# Altium project RobotControlBoard.PrjPcb
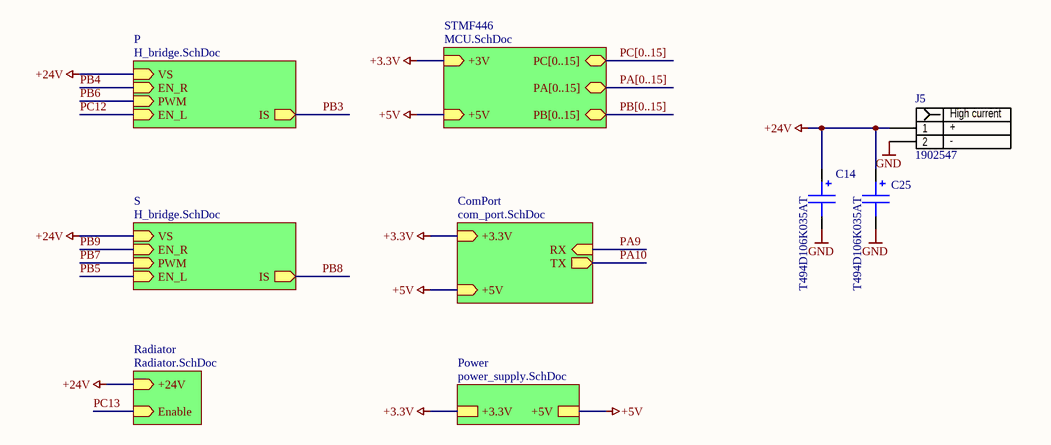
[diagram p0: MAIN.SchDoc]
6 sheets, 70 parts. Net scope: hierarchical (ports join the sheet entries above them; power ports are global).
Board file: RobotPCB.PcbDoc
Sheets:
  MAIN.SchDoc
    STMF446 = MCU.SchDoc
    P = H_bridge.SchDoc
    S = H_bridge.SchDoc
    СomPort = com_port.SchDoc
    Power = power_supply.SchDoc
    Radiator = Radiator.SchDoc

## Sheet MAIN.SchDoc: Main
size A4; DrawnBy: Zigman Nikita; Organization: Zigman Nikita; Address3: zigman.nikita@gmail.com; DocumentNumber: 1.0; Revision: ZN; SheetNumber: 1; SheetTotal: 6

### Parts
C14  T494D106K035AT  [CAPPM7343X310N]
C25  T494D106K035AT  [CAPPM7343X310N]
J5  1902547  [1902547]

### Sub-sheets
P = H_bridge.SchDoc: EN_R (in), IS (out), PWM (in), EN_L (in), VS (in)
Power = power_supply.SchDoc: +5V, +3.3V
Radiator = Radiator.SchDoc: Enable (in), +24V (in)
S = H_bridge.SchDoc: EN_R (in), PWM (in), EN_L (in), VS (in), IS (out)
STMF446 = MCU.SchDoc: PC[0..15] (bidir), PA[0..15] (bidir), +3V (in), PB[0..15] (bidir), +5V (in)
СomPort = com_port.SchDoc: RX (in), +3.3V (in), TX (out), +5V (in)

### Nets
+3.3V: sheet STMF446/+3V, sheet СomPort/+3.3V, sheet Power/+3.3V
+5V: sheet STMF446/+5V, sheet СomPort/+5V, sheet Power/+5V  [project net VBUS]
+24V: C14.1(+) C25.1(+) J5.1 ; sheet P/VS, sheet S/VS, sheet Radiator/+24V  [project net VS]
GND: C14.2(-) C25.2(-) J5.2

### Buses and harness runs
bus PA[0..15] = sheet STMF446/PA[0..15]
bus PB[0..15] = sheet STMF446/PB[0..15]
bus PC[0..15] = sheet STMF446/PC[0..15]

### Notes on the sheet
- Title
- Size:
- Date:
- A4
- Number:
- Time:
- Revision:
- Sheet
- of
- File:
- (in symbol 1902547) High current; +; -

### Library data of the parts
C14 C25 = T494D106K035AT: Capacitor Polarised; Manufacturer_Name: Kemet; Datasheet Link: http://www.mouser.com/ds/2/212/kemet_kem_t2008_t494-544880.pdf; Height: 3.1mm; Manufacturer_Part_Number: T494D106K035AT; Arrow Part Number: T494D106K035AT; Arrow Price/Stock: https://www.arrow.com/en/products/t494d106k035at/kemet-corporation; Mouser Part Number: 80-T494D106K035; Mouser Price/Stock: https://www.mouser.com/Search/Refine.aspx?Keyword=80-T494D106K035
J5 = 1902547: Connector; Manufacturer_Name: Phoenix Contact; Datasheet Link: https://www.arrow.com/en/products/1902547/phoenix-contact; Height: 21.7mm; Manufacturer_Part_Number: 1902547; Arrow Part Number: 1902547; Arrow Price/Stock: https://www.arrow.com/en/products/1902547/phoenix-contact; Mouser Part Number: 651-1902547; Mouser Price/Stock: https://www.mouser.co.uk/ProductDetail/Phoenix-Contact/1902547?qs=wd%252Bw3mUqFrmbAnEXicRpKg%3D%3D

## Sheet MCU.SchDoc: MCU
size A4; Organization: Zigman NIkita; Address3: zigman.nikita@gmail.com; DocumentNumber: 1.0; Revision: ZN; SheetNumber: 2; SheetTotal: 6
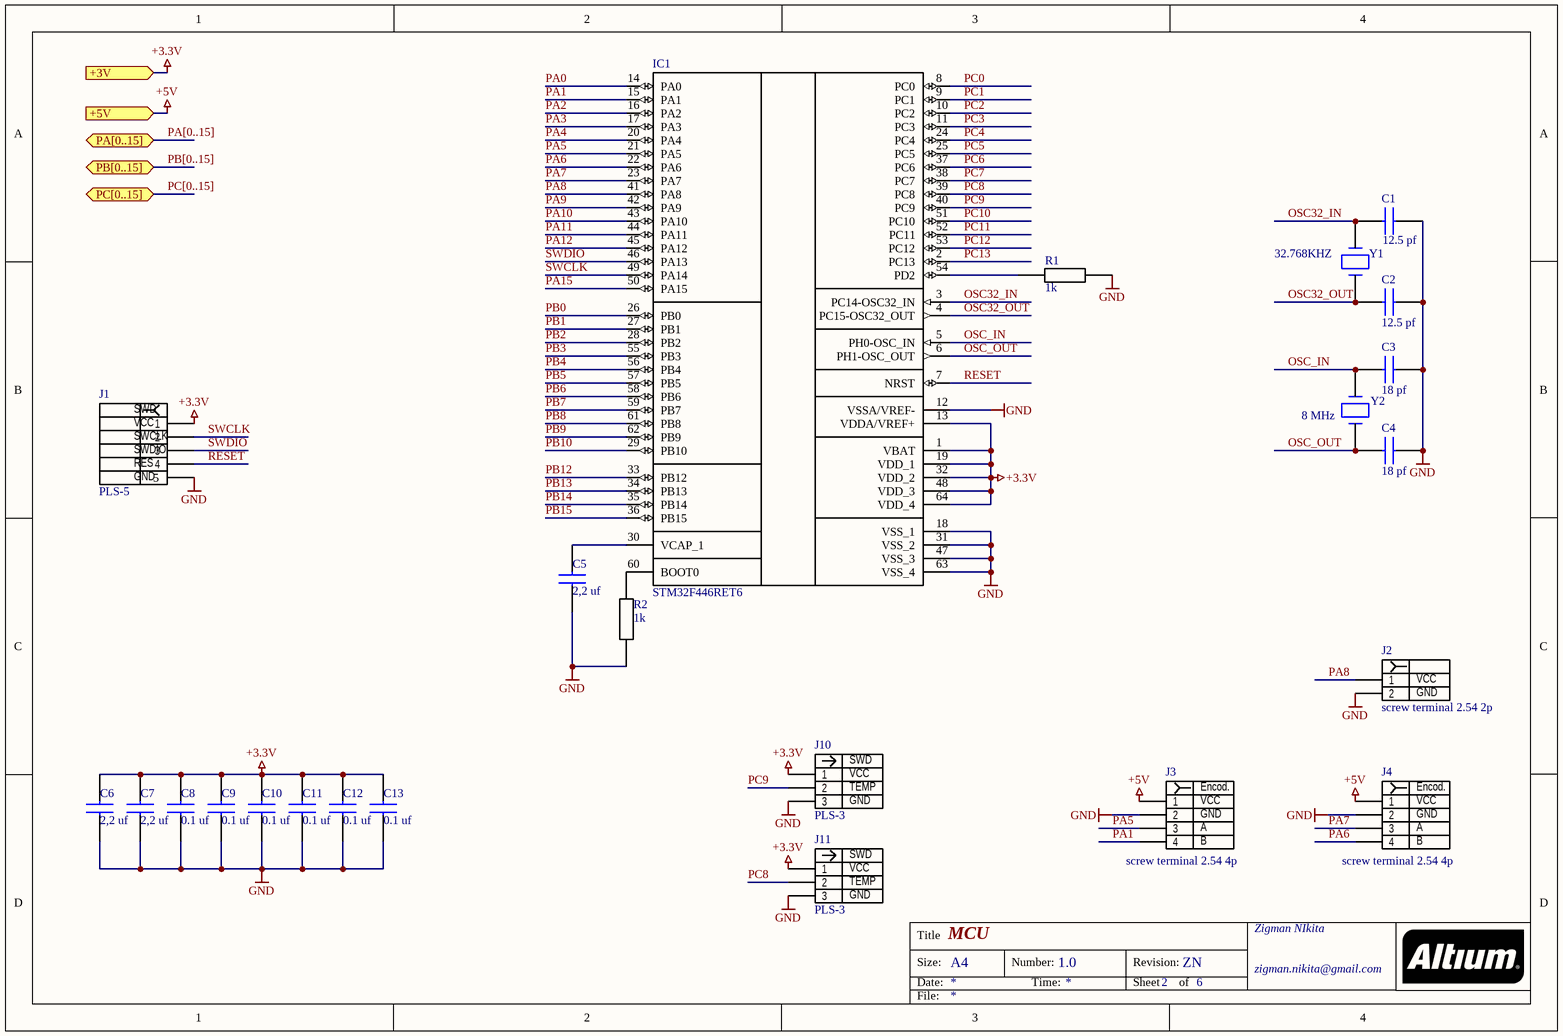
[diagram p1: MCU.SchDoc]

### Parts
C1  12.5 pf  [CAPC1608X90N]
C2  12.5 pf  [CAPC1608X90N]
C3  18 pf  [CAPC1608X90N]
C4  18 pf  [CAPC1608X90N]
C5  2,2 uf  [CAPC1608X90N]
C6  2,2 uf  [CAPC1608X90N]
C7  2,2 uf  [CAPC1608X90N]
C8  0.1 uf  [CAPC1608X90N]
C9  0.1 uf  [CAPC1608X90N]
C10  0.1 uf  [CAPC1608X90N]
C11  0.1 uf  [CAPC1608X90N]
C12  0.1 uf  [CAPC1608X90N]
C13  0.1 uf  [CAPC1608X90N]
IC1  STM32F446RET6  [QFP50P1200X1200X160-64N]
J1  PLS-5  [TE_826646-5]
J2  screw terminal 2.54 2p  [1725672-2-2.54]
J3  screw terminal 2.54 4p  [1725672-4-2.54]
J4  screw terminal 2.54 4p  [1725672-4-2.54]
J10  PLS-3  [TE_826646-3]
J11  PLS-3  [TE_826646-3]
R1  1k  [RESC1608X55N]
R2  1k  [RESC1608X55N]
Y1  32.768KHZ  [9HT1132768KDZBT]
Y2  8 MHz  [ABM2]

### Ports
+3V (in), +5V (in), PA[0..15] (bidir), PB[0..15] (bidir), PC[0..15] (bidir)

### Nets
+3.3V: C6.2 C7.2 C8.2 C9.2 C10.2 C11.2 C12.2 C13.2 IC1.1(VBAT) IC1.13(VDDA/VREF+) IC1.19(VDD_1) IC1.32(VDD_2) IC1.48(VDD_3) IC1.64(VDD_4) J1.1 J10.1 J11.1 ; port +3V
+5V: J3.1 J4.1 ; port +5V  [project net VBUS]
GND: C1.1 C2.1 C3.1 C4.1 C5.1 C6.1 C7.1 C8.1 C9.1 C10.1 C11.1 C12.1 C13.1 IC1.12(VSSA/VREF-) IC1.18(VSS_1) IC1.31(VSS_2) IC1.47(VSS_3) IC1.63(VSS_4) J1.5 J2.2 J3.2 J4.2 J10.3 J11.3 R1.1 R2.2
OSC32_IN: C1.2 IC1.3(PC14-OSC32_IN) Y1.2
OSC32_OUT: C2.2 IC1.4(PC15-OSC32_OUT) Y1.1
OSC_IN: C3.2 IC1.5(PH0-OSC_IN) Y2.2
OSC_OUT: C4.2 IC1.6(PH1-OSC_OUT) Y2.1
PA0: IC1.14(PA0)
PA1: IC1.15(PA1) J3.4
PA2: IC1.16(PA2)
PA3: IC1.17(PA3)
PA4: IC1.20(PA4)
PA5: IC1.21(PA5) J3.3
PA6: IC1.22(PA6) J4.4
PA7: IC1.23(PA7) J4.3
PA8: IC1.41(PA8) J2.1
PA9: IC1.42(PA9)
PA10: IC1.43(PA10)
PA11: IC1.44(PA11)
PA12: IC1.45(PA12)
PA15: IC1.50(PA15)
PB0: IC1.26(PB0)
PB1: IC1.27(PB1)
PB2: IC1.28(PB2)
PB3: IC1.55(PB3)  [project net IS]
PB4: IC1.56(PB4)  [project net EN_R]
PB5: IC1.57(PB5)  [project net EN_L]
PB6: IC1.58(PB6)
PB7: IC1.59(PB7)
PB8: IC1.61(PB8)  [project net IS]
PB9: IC1.62(PB9)  [project net EN_R]
PB10: IC1.29(PB10)
PB12: IC1.33(PB12)
PB13: IC1.34(PB13)
PB14: IC1.35(PB14)
PB15: IC1.36(PB15)
PC0: IC1.8(PC0)
PC1: IC1.9(PC1)
PC2: IC1.10(PC2)
PC3: IC1.11(PC3)
PC4: IC1.24(PC4)
PC5: IC1.25(PC5)
PC6: IC1.37(PC6)
PC7: IC1.38(PC7)
PC8: IC1.39(PC8) J11.2
PC9: IC1.40(PC9) J10.2
PC10: IC1.51(PC10)
PC11: IC1.52(PC11)
PC12: IC1.53(PC12)  [project net EN_L]
PC13: IC1.2(PC13)
RESET: IC1.7(NRST) J1.4
SWCLK: IC1.49(PA14) J1.2
SWDIO: IC1.46(PA13) J1.3
NetC5_2: C5.2 IC1.30(VCAP_1)
NetIC1_54: IC1.54(PD2) R1.2
NetIC1_60: IC1.60(BOOT0) R2.1

### Buses and harness runs
bus PA[0..15] = port PA[0..15]
bus PB[0..15] = port PB[0..15]
bus PC[0..15] = port PC[0..15]

### Notes on the sheet
- Title
- Size:
- Date:
- A4
- Number:
- Time:
- Revision:
- Sheet
- of
- File:
- (in symbol PLS-3) SWD; VCC; TEMP; GND
- (in symbol PLS-5) SWD; VCC; SWCLK; SWDIO; RES; GND
- (in symbol screw terminal 2.54 2p) VCC; GND
- (in symbol screw terminal 2.54 4p) Encod.; VCC; GND; A; B

### Library data of the parts
C1-C4 = 0603: AVX 18pF 200V dc 0603; Datasheet Link: https://at.rs-online.com/web/p/keramik-vielschichtkondensatoren/6983970/; Height: 0.9mm; Manufacturer_Name: AVX
C5-C7 = 0603: Murata 2.2 uF X7R 10% 10V dc 0603; Manufacturer_Part_Number: 06033C393JAT2A; Datasheet Link: https://at.rs-online.com/web/p/keramik-vielschichtkondensatoren/7235597/; Height: 0.9mm; Manufacturer_Name: Murata
C8-C13 = 0603: AVX 0.1 uF 16v dc 0603; Datasheet Link: https://at.rs-online.com/web/p/keramik-vielschichtkondensatoren/1358340/; Height: 0.9mm; Manufacturer_Name: AVX
IC1 = STM32F446RET6: Integrated Circuit; Manufacturer_Name: STMicroelectronics; Datasheet Link: http://docs-emea.rs-online.com/webdocs/14d7/0900766b814d7c59.pdf; Height: 1.6mm; Manufacturer_Part_Number: STM32F446RET6; Arrow Part Number: STM32F446RET6; Arrow Price/Stock: https://www.arrow.com/en/products/stm32f446ret6/stmicroelectronics; Mouser Part Number: 511-STM32F446RET6; Mouser Price/Stock: https://www.mouser.co.uk/ProductDetail/STMicroelectronics/STM32F446RET6?qs=Ok1pvOkw6%2FqpQsWf8F4wtQ%3D%3D
J1 = PLS-5: Board-To-Board Connector, Through Hole, Header, 5, 2.54 mm, Gold Plated Contacts; MF: TE Connectivity; MP: 826646-5; SnapEDA_Link: https://www.snapeda.com/parts/826646-5/TE%20Connectivity%20AMP%20Connectors/view-part/2389611/?ref=snap; TE_purchase_URL: https://www.te.com/usa-en/product-826646-5.html?te_bu=Cor&te_type=disp&te_campaign=seda_glo_cor-seda-global-disp-prtnr-fy19-seda-model-bom-cta_sma-317_1&elqCampaignId=32493; Availability: Unavailable; Value: *; EU_RoHS_Compliance: Compliant; Price: None; Package: None
J2 = screw terminal 2.54 2p: Connector; Manufacturer_Name: Phoenix Contact; Manufacturer_Part_Number: 1725672; Datasheet Link: https://www.phoenixcontact.com/online/portal/us?uri=pxc-oc-itemdetail:pid=1725672&library=usen&tab=1.pdf; Arrow Part Number: 1725672; Arrow Price/Stock: https://www.arrow.com/en/products/1725672/phoenix-contact; Mouser Part Number: 651-1725672; Mouser Price/Stock: https://www.mouser.co.uk/ProductDetail/Phoenix-Contact/1725672?qs=Ul7CXFMnlWXX93F9bOV2pQ%3D%3D
J3 J4 = screw terminal 2.54 4p: Connector; Manufacturer_Name: Phoenix Contact; Manufacturer_Part_Number: 1725672; Datasheet Link: https://www.phoenixcontact.com/online/portal/us?uri=pxc-oc-itemdetail:pid=1725672&library=usen&tab=1.pdf; Arrow Part Number: 1725672; Arrow Price/Stock: https://www.arrow.com/en/products/1725672/phoenix-contact; Mouser Part Number: 651-1725672; Mouser Price/Stock: https://www.mouser.co.uk/ProductDetail/Phoenix-Contact/1725672?qs=Ul7CXFMnlWXX93F9bOV2pQ%3D%3D
J10 J11 = PLS-3: Board-To-Board Connector, Through Hole, Header, 5, 2.54 mm, Gold Plated Contacts; MF: TE Connectivity; MP: 826646-5; SnapEDA_Link: https://www.snapeda.com/parts/826646-5/TE%20Connectivity%20AMP%20Connectors/view-part/2389611/?ref=snap; TE_purchase_URL: https://www.te.com/usa-en/product-826646-5.html?te_bu=Cor&te_type=disp&te_campaign=seda_glo_cor-seda-global-disp-prtnr-fy19-seda-model-bom-cta_sma-317_1&elqCampaignId=32493; Availability: Unavailable; Value: *; EU_RoHS_Compliance: Compliant; Price: None; Package: None
R1 R2 = res 0603: RS PRO SMD-Widerstand, 1kΩ ±5%; Manufacturer_Name: RS PRO; Datasheet Link: https://at.rs-online.com/web/p/smd-widerstande/7134141/; Height: 0.55mm
Y1 = CM7V-T1A 32.768KHZ: Quarz CM7V-T1A 32.768KHZ 7PF +/-20PPM TB QA 32.768kHz, ±20ppm; Manufacturer_Name: CM7V; Datasheet Link: https://at.rs-online.com/web/p/schwingquarz/1735831/; Height: 0.6mm; Manufacturer_Part_Number: CM7V-T1A
Y2 = ABM2-8.000MHZ-D4Y-T: Quarz ABM2-8.000MHZ-D4Y-T 8MHz, ±30ppm; Manufacturer_Name: ABM; Datasheet Link: https://at.rs-online.com/web/p/schwingquarz/1710612/; Height: 1.6 mm; Manufacturer_Part_Number: ABM2-8.000MHZ-D4Y-T

## Sheet H_bridge.SchDoc: H bridge
size A4; Organization: Zigman NIkita; Address3: zigman.nikita@gmail.com; DocumentNumber: 1.0; Revision: ZN; SheetNumber: 3; SheetTotal: 6
Used 2 times, as channels P, S. Parts and nets are listed once, with the designators drawn on the sheet.
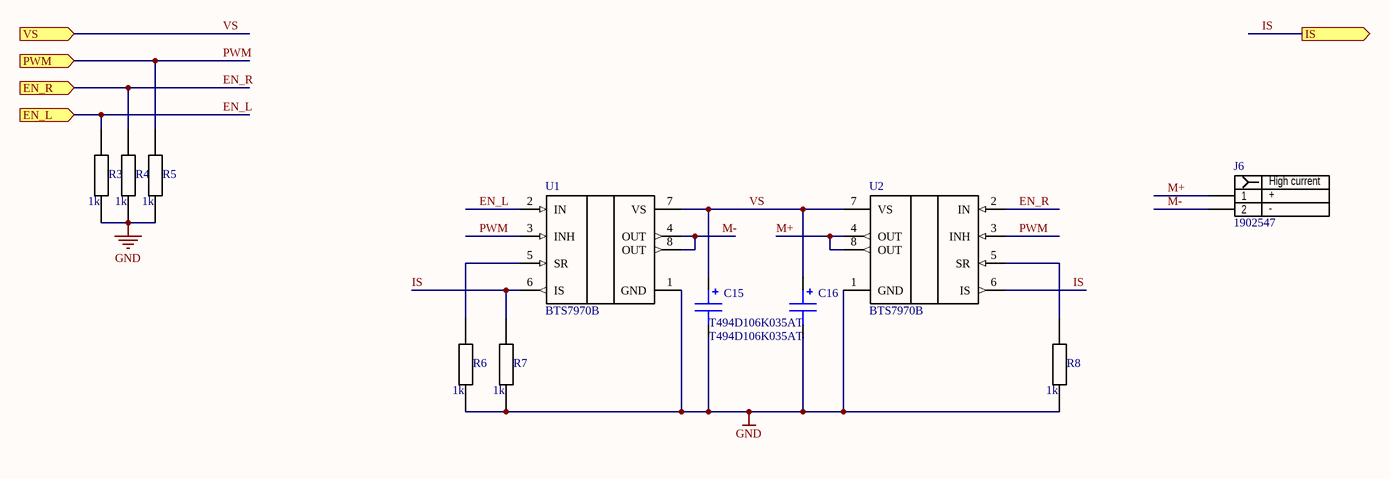
[diagram p2: H_bridge.SchDoc]

### Parts
C15  T494D106K035AT  [CAPPM7343X310N]
C16  T494D106K035AT  [CAPPM7343X310N]
J6  1902547  [1902547]
R3  1k  [RESC1608X55N]
R4  1k  [RESC1608X55N]
R5  1k  [RESC1608X55N]
R6  1k  [RESC1608X55N]
R7  1k  [RESC1608X55N]
R8  1k  [RESC1608X55N]
U1  BTS7970B  [PG-TO263-7-1]
U2  BTS7970B  [PG-TO263-7-1]

### Ports
EN_L (in), EN_R (in), IS (out), PWM (in), VS (in)

### Nets
GND: C15.2(-) C16.2(-) R3.1 R4.1 R5.1 R6.1 R7.1 R8.1 U1.1(GND) U2.1(GND)
EN_L: R3.2 U1.2(IN) ; port EN_L
EN_R: R4.2 U2.2(IN) ; port EN_R
IS: R7.2 U1.6(IS) U2.6(IS) ; port IS
M+: J6.1 U2.4(OUT) U2.8(OUT)
M-: J6.2 U1.4(OUT) U1.8(OUT)
PWM: R5.2 U1.3(INH) U2.3(INH) ; port PWM
VS: C15.1(+) C16.1(+) U1.7(VS) U2.7(VS) ; port VS
NetR6_2: R6.2 U1.5(SR)
NetR8_2: R8.2 U2.5(SR)

### Channels
P: designators end in _P; ports EN_L=EN_L EN_R=EN_R IS=IS PWM=PB6 VS=VS
S: designators end in _S; ports EN_L=EN_L EN_R=EN_R IS=IS PWM=PB7 VS=VS

### Notes on the sheet
- Title
- Size:
- Date:
- A4
- Number:
- Time:
- Revision:
- Sheet
- of
- File:
- (in symbol 1902547) High current; +; -

### Library data of the parts
C15 C16 = T494D106K035AT: as C14 on sheet MAIN; Datasheet Link: http://www.mouser.com/ds/2/212/kemet_kem_t2008_t494-544880.pdf; Height: 3.1mm; Manufacturer_Part_Number: T494D106K035AT; Arrow Part Number: T494D106K035AT; Arrow Price/Stock: https://www.arrow.com/en/products/t494d106k035at/kemet-corporation; Mouser Part Number: 80-T494D106K035; Mouser Price/Stock: https://www.mouser.com/Search/Refine.aspx?Keyword=80-T494D106K035
J6 = 1902547: Phoenix Contact MKDS 5 HV/2-9.52; Datasheet Link: https://www.arrow.com/en/products/1902547/phoenix-contact; Height: 21.7mm; Manufacturer_Name: Phoenix Contact; Manufacturer_Part_Number: 1902547; Arrow Part Number: 1902547; Arrow Price/Stock: https://www.arrow.com/en/products/1902547/phoenix-contact; Mouser Part Number: 651-1902547; Mouser Price/Stock: https://www.mouser.co.uk/ProductDetail/Phoenix-Contact/1902547?qs=wd%252Bw3mUqFrmbAnEXicRpKg%3D%3D
R3-R8 = res 0603: as R1 on sheet MCU; Datasheet Link: https://at.rs-online.com/web/p/smd-widerstande/7134141/; Height: 0.55mm
U1 U2 = BTS7970B: Infineon Motor Driver IC BTN7970BAUMA1, 50A, 25kHz, TO-263, 7-Pin, BLDC; MF: Infineon; SnapEDA_Link: https://at.rs-online.com/web/p/motor-treiber-ics/7264068/; MP: BTS7970B; Price: None; Package: PG-TO263-7-1; Value: *; Availability: Unavailable

## Sheet com_port.SchDoc: COM Port
size A4; Organization: Zigman Nikita; Address3: zigman.nikita@gmail.com; DocumentNumber: 1.0; Revision: ZN; SheetNumber: 4; SheetTotal: 6
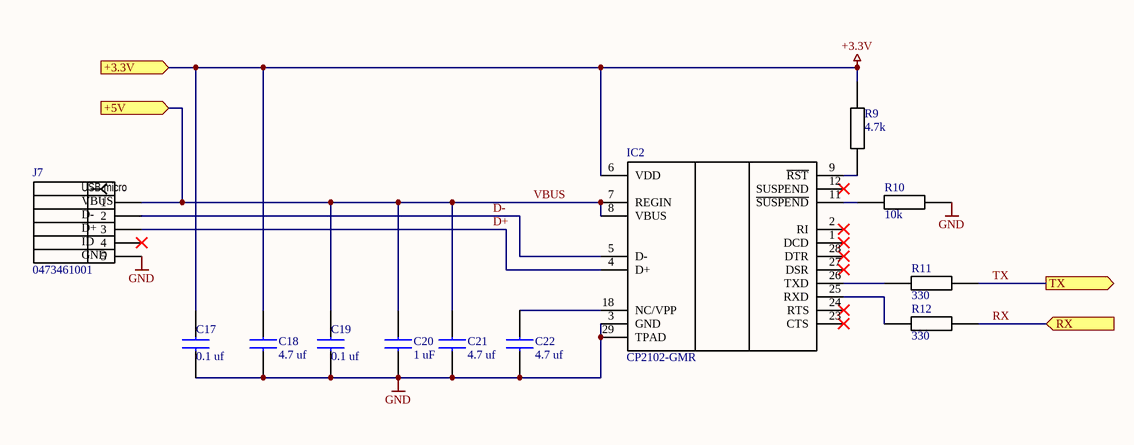
[diagram p3: com_port.SchDoc]

### Parts
C17  0.1 uf  [CAPC1608X90N]
C18  4.7 uf  [CAPC1608X90N]
C19  0.1 uf  [CAPC1608X90N]
C20  1 uF  [CAPC1608X90N]
C21  4.7 uf  [CAPC1608X90N]
C22  4.7 uf  [CAPC1608X90N]
IC2  CP2102-GMR  [QFN50P500X500X100-29N-D]
J7  0473461001  [0473461001]
R9  4.7k  [RESC1608X55N]
R10  10k  [RESC1608X55N]
R11  330  [RESC1608X55N]
R12  330  [RESC1608X55N]

### Ports
+3.3V (in), +5V (in), RX (in), TX (out)

### Nets
+3.3V: C17.2 C18.2 IC2.6(VDD) R9.2 ; port +3.3V
GND: C17.1 C18.1 C19.1 C20.1 C21.1 C22.1 IC2.3(GND) IC2.29(TPAD) J7.5 R10.1
VBUS: C19.2 C20.2 C21.2 IC2.7(REGIN) IC2.8(VBUS) J7.1 ; port +5V
D+: IC2.4(D+) J7.3
D-: IC2.5(D-) J7.2
RX: R12.1 ; port RX  [project net PA9]
TX: R11.1 ; port TX  [project net PA10]
NetC22_2: C22.2 IC2.18(NC/VPP)
NetIC2_9: IC2.9(~{RST}) R9.1
NetIC2_11: IC2.11(~{SUSPEND}) R10.2
NetIC2_25: IC2.25(RXD) R12.2
NetIC2_26: IC2.26(TXD) R11.2

Not connected (* = marked no-connect by the designer): IC2 1(DCD)* 2(RI)* 12(SUSPEND)* 23(CTS)* 24(RTS)* 27(DSR)* 28(DTR)*; J7 4*

### Notes on the sheet
- Title
- Size:
- Date:
- A4
- Number:
- Time:
- Revision:
- Sheet
- of
- File:
- (in symbol 0473461001) USB micro; VBUS; D-; D+; ID; GND

### Library data of the parts
C17 C19 = 0603: AVX 0.1 uF 16v dc 0603; Datasheet Link: https://at.rs-online.com/web/p/keramik-vielschichtkondensatoren/1358340/; Height: 0.9mm; Manufacturer_Name: AVX
C18 C21 C22 = 0603: AVX, SMD MLCC 4.7 uF 10 V dc, 0603; Datasheet Link: https://at.rs-online.com/web/p/keramik-vielschichtkondensatoren/1353676/; Height: 0.9mm; Manufacturer_Name: AVX
C20 = 0603: AVX SMD 1uF 16V 0603; Datasheet Link: https://at.rs-online.com/web/p/keramik-vielschichtkondensatoren/8882257/; Height: 0.9mm; Manufacturer_Name: AVX
IC2 = CP2102-GMR: Integrated Circuit; Manufacturer_Name: Silicon Labs; Datasheet Link: https://at.rs-online.com/web/p/multiprotokoll-transceiver/5268841/; Height: 1mm; Manufacturer_Part_Number: CP2102-GMR; Arrow Part Number: CP2102-GMR; Arrow Price/Stock: https://www.arrow.com/en/products/cp2102-gmr/silicon-labs; Mouser Part Number: 634-CP2102-GMR; Mouser Price/Stock: https://www.mouser.co.uk/ProductDetail/Silicon-Labs/CP2102-GMR?qs=cNyzPCcHMUWu%2FiPhR8KQAw%3D%3D
J7 = 0473461001: Connector; Manufacturer_Name: Molex; Datasheet Link: https://componentsearchengine.com/Datasheets/1/0473461001.pdf; Height: 2.45mm; Manufacturer_Part_Number: 0473461001; Arrow Part Number: 0473461001; Arrow Price/Stock: https://www.arrow.com/en/products/0473461001/molex; Mouser Part Number: N/A; Mouser Price/Stock: https://www.mouser.com/Search/Refine.aspx?Keyword=N%2FA
R9 = res 0603: 4.7k 0603; Manufacturer_Name: TE Connectivity; Manufacturer_Part_Number: CPF0603B100RE1; Datasheet Link: http://www.farnell.com/datasheets/1786775.pdf; Height: 0.55mm; Arrow Part Number: CPF0603B100RE1; Arrow Price/Stock: https://www.arrow.com/en/products/cpf0603b100re1/te-connectivity; Mouser Part Number: 279-CPF0603B100RE1; Mouser Price/Stock: https://www.mouser.co.uk/ProductDetail/TE-Connectivity-Neohm/CPF0603B100RE1?qs=DfH2yQaBz6s2KWheq2AlNw%3D%3D
R10 = res 0603: 10k 0603; Manufacturer_Name: TE Connectivity; Manufacturer_Part_Number: CPF0603B100RE1; Datasheet Link: http://www.farnell.com/datasheets/1786775.pdf; Height: 0.55mm; Arrow Part Number: CPF0603B100RE1; Arrow Price/Stock: https://www.arrow.com/en/products/cpf0603b100re1/te-connectivity; Mouser Part Number: 279-CPF0603B100RE1; Mouser Price/Stock: https://www.mouser.co.uk/ProductDetail/TE-Connectivity-Neohm/CPF0603B100RE1?qs=DfH2yQaBz6s2KWheq2AlNw%3D%3D
R11 R12 = res 0603: 330 0603; Manufacturer_Name: TE Connectivity; Manufacturer_Part_Number: CPF0603B100RE1; Datasheet Link: http://www.farnell.com/datasheets/1786775.pdf; Height: 0.55mm; Arrow Part Number: CPF0603B100RE1; Arrow Price/Stock: https://www.arrow.com/en/products/cpf0603b100re1/te-connectivity; Mouser Part Number: 279-CPF0603B100RE1; Mouser Price/Stock: https://www.mouser.co.uk/ProductDetail/TE-Connectivity-Neohm/CPF0603B100RE1?qs=DfH2yQaBz6s2KWheq2AlNw%3D%3D

## Sheet power_supply.SchDoc: Power supply
size A4; Organization: Zigman NIkita; Address3: zigman.nikita@gmail.com; DocumentNumber: 1.0; Revision: ZN; SheetNumber: 5; SheetTotal: 6
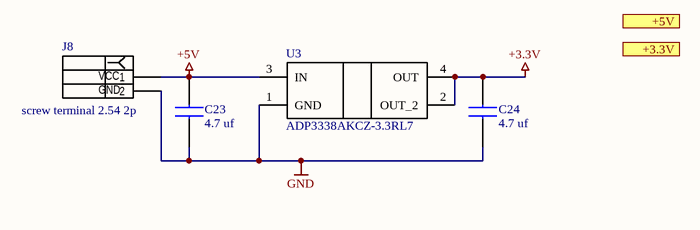
[diagram p4: power_supply.SchDoc]

### Parts
C23  4.7 uf  [CAPC1608X90N]
C24  4.7 uf  [CAPC1608X90N]
J8  screw terminal 2.54 2p  [1725672-2-2.54]
U3  ADP3338AKCZ-3.3RL7  [SOT230-3]

### Ports
+3.3V, +5V

### Nets
+3.3V: C24.2 U3.2(OUT_2) U3.4(OUT) ; port +3.3V
+5V: C23.2 J8.1 U3.3(IN) ; port +5V  [project net VBUS]
GND: C23.1 C24.1 J8.2 U3.1(GND)

### Notes on the sheet
- Title
- Size:
- Date:
- A4
- Number:
- Time:
- Revision:
- Sheet
- of
- File:
- (in symbol screw terminal 2.54 2p) VCC; GND

### Library data of the parts
C23 C24 = 0603: AVX, SMD MLCC 4.7 uF 10 V dc, 0603; Datasheet Link: https://at.rs-online.com/web/p/keramik-vielschichtkondensatoren/1353676/; Height: 0.9mm; Manufacturer_Name: AVX
J8 = screw terminal 2.54 2p: as J2 on sheet MCU; Datasheet Link: https://www.phoenixcontact.com/online/portal/us?uri=pxc-oc-itemdetail:pid=1725672&library=usen&tab=1.pdf; Arrow Part Number: 1725672; Arrow Price/Stock: https://www.arrow.com/en/products/1725672/phoenix-contact; Mouser Part Number: 651-1725672; Mouser Price/Stock: https://www.mouser.co.uk/ProductDetail/Phoenix-Contact/1725672?qs=Ul7CXFMnlWXX93F9bOV2pQ%3D%3D
U3 = ADP3338AKCZ-3.3RL7: Linear Voltage Regulator IC 1 Output 1A SOT-223-3; MF: Analog Devices; Value: *; Mouser-Purchase-URL: https://snapeda.com/shop?store=Mouser&id=51107; Package: SOT-223 Analog Devices; DigiKey-Purchase-URL: https://snapeda.com/shop?store=DigiKey&id=51107; Price: None; MP: ADP3338AKCZ-3.3RL7; Availability: Good; SnapEDA_Link: https://www.snapeda.com/parts/ADP3338AKCZ-3.3RL7/Analog%20Devices%20Inc./view-part/51107/?ref=snap; Arrow_Electronics-Purchase-URL: https://snapeda.com/shop?store=Arrow+Electronics&id=51107

## Sheet Radiator.SchDoc: Cooler
size A4; Organization: Zigman Nikita; Address3: zigman.nikita@gmail.com; DocumentNumber: 1.0; Revision: ZN; SheetNumber: 6; SheetTotal: 6
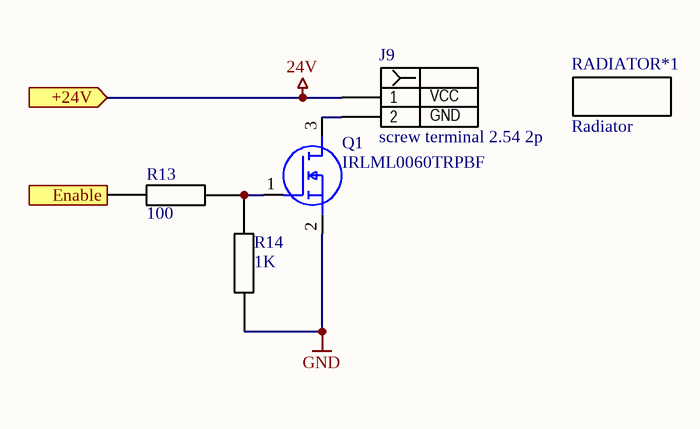
[diagram p5: Radiator.SchDoc]

### Parts
J9  screw terminal 2.54 2p  [1725672-2-2.54]
Q1  IRLML0060TRPBF  [SOT95P237X112-3N]
R13  100  [RESC1608X55N]
R14  1K  [RESC1608X55N]
RADIATOR*1  Radiator  [SK68-75-SA]

### Ports
+24V (in), Enable (in)

### Nets
24V: J9.1 ; port +24V  [project net VS]
GND: Q1.2(S) R14.1
PC13: R13.2 ; port Enable
NetJ9_2: J9.2 Q1.3(D)
NetQ1_1: Q1.1(G) R13.1 R14.2

### Notes on the sheet
- Title
- Size:
- Date:
- A4
- Number:
- Time:
- Revision:
- Sheet
- of
- File:
- (in symbol screw terminal 2.54 2p) VCC; GND

### Library data of the parts
J9 = screw terminal 2.54 2p: as J2 on sheet MCU; Datasheet Link: https://www.phoenixcontact.com/online/portal/us?uri=pxc-oc-itemdetail:pid=1725672&library=usen&tab=1.pdf; Arrow Part Number: 1725672; Arrow Price/Stock: https://www.arrow.com/en/products/1725672/phoenix-contact; Mouser Part Number: 651-1725672; Mouser Price/Stock: https://www.mouser.co.uk/ProductDetail/Phoenix-Contact/1725672?qs=Ul7CXFMnlWXX93F9bOV2pQ%3D%3D
Q1 = IRLML0060TRPBF: MOSFET (N-Channel); Manufacturer_Name: Infineon; Datasheet Link: https://www.infineon.com/dgdl/irlml0060pbf.pdf?fileId=5546d462533600a40153566493ef25e6; Height: 1.12mm; Manufacturer_Part_Number: IRLML0060TRPBF; Arrow Part Number: IRLML0060TRPBF; Arrow Price/Stock: https://www.arrow.com/en/products/irlml0060trpbf/infineon-technologies-ag; Mouser Part Number: 942-IRLML0060TRPBF; Mouser Price/Stock: https://www.mouser.co.uk/ProductDetail/Infineon-IR/IRLML0060TRPBF?qs=9%252BKlkBgLFf3sC4ri8n%252Bt9Q%3D%3D
R13 = res 0603: 100 0603; Manufacturer_Name: TE Connectivity; Manufacturer_Part_Number: CPF0603B100RE1; Datasheet Link: http://www.farnell.com/datasheets/1786775.pdf; Height: 0.55mm; Arrow Part Number: CPF0603B100RE1; Arrow Price/Stock: https://www.arrow.com/en/products/cpf0603b100re1/te-connectivity; Mouser Part Number: 279-CPF0603B100RE1; Mouser Price/Stock: https://www.mouser.co.uk/ProductDetail/TE-Connectivity-Neohm/CPF0603B100RE1?qs=DfH2yQaBz6s2KWheq2AlNw%3D%3D
R14 = res 0603: 1k 0603; Manufacturer_Name: TE Connectivity; Manufacturer_Part_Number: CPF0603B100RE1; Datasheet Link: http://www.farnell.com/datasheets/1786775.pdf; Height: 0.55mm; Arrow Part Number: CPF0603B100RE1; Arrow Price/Stock: https://www.arrow.com/en/products/cpf0603b100re1/te-connectivity; Mouser Part Number: 279-CPF0603B100RE1; Mouser Price/Stock: https://www.mouser.co.uk/ProductDetail/TE-Connectivity-Neohm/CPF0603B100RE1?qs=DfH2yQaBz6s2KWheq2AlNw%3D%3D

## Nets that join several sheets
+3.3V: MCU (17 pins), com_port (C17.2 C18.2 IC2.6 R9.2), power_supply (C24.2 U3.2 U3.4)
GND: MAIN (C14.2 C25.2 J5.2), MCU (26 pins), P (10 pins), S (10 pins), com_port (10 pins), power_supply (C23.1 C24.1 J8.2 U3.1), Radiator (Q1.2 R14.1)
VBUS: MCU (J3.1 J4.1), com_port (6 pins), power_supply (C23.2 J8.1 U3.3)
VS: MAIN (C14.1 C25.1 J5.1), P (C15_P.1 C16_P.1 U1_P.7 U2_P.7), S (C15_S.1 C16_S.1 U1_S.7 U2_S.7), Radiator (J9.1)
EN_L: MCU (IC1.57), S (R3_S.2 U1_S.2)
EN_L: MCU (IC1.53), P (R3_P.2 U1_P.2)
EN_R: MCU (IC1.62), S (R4_S.2 U2_S.2)
EN_R: MCU (IC1.56), P (R4_P.2 U2_P.2)
IS: MCU (IC1.61), S (R7_S.2 U1_S.6 U2_S.6)
IS: MCU (IC1.55), P (R7_P.2 U1_P.6 U2_P.6)
PA9: MCU (IC1.42), com_port (R12.1)
PA10: MCU (IC1.43), com_port (R11.1)
PB6: MCU (IC1.58), P (R5_P.2 U1_P.3 U2_P.3)
PB7: MCU (IC1.59), S (R5_S.2 U1_S.3 U2_S.3)
PC13: MCU (IC1.2), Radiator (R13.2)